# Altium schematic sheet STM32F4_Schematics.SchDoc
size A4
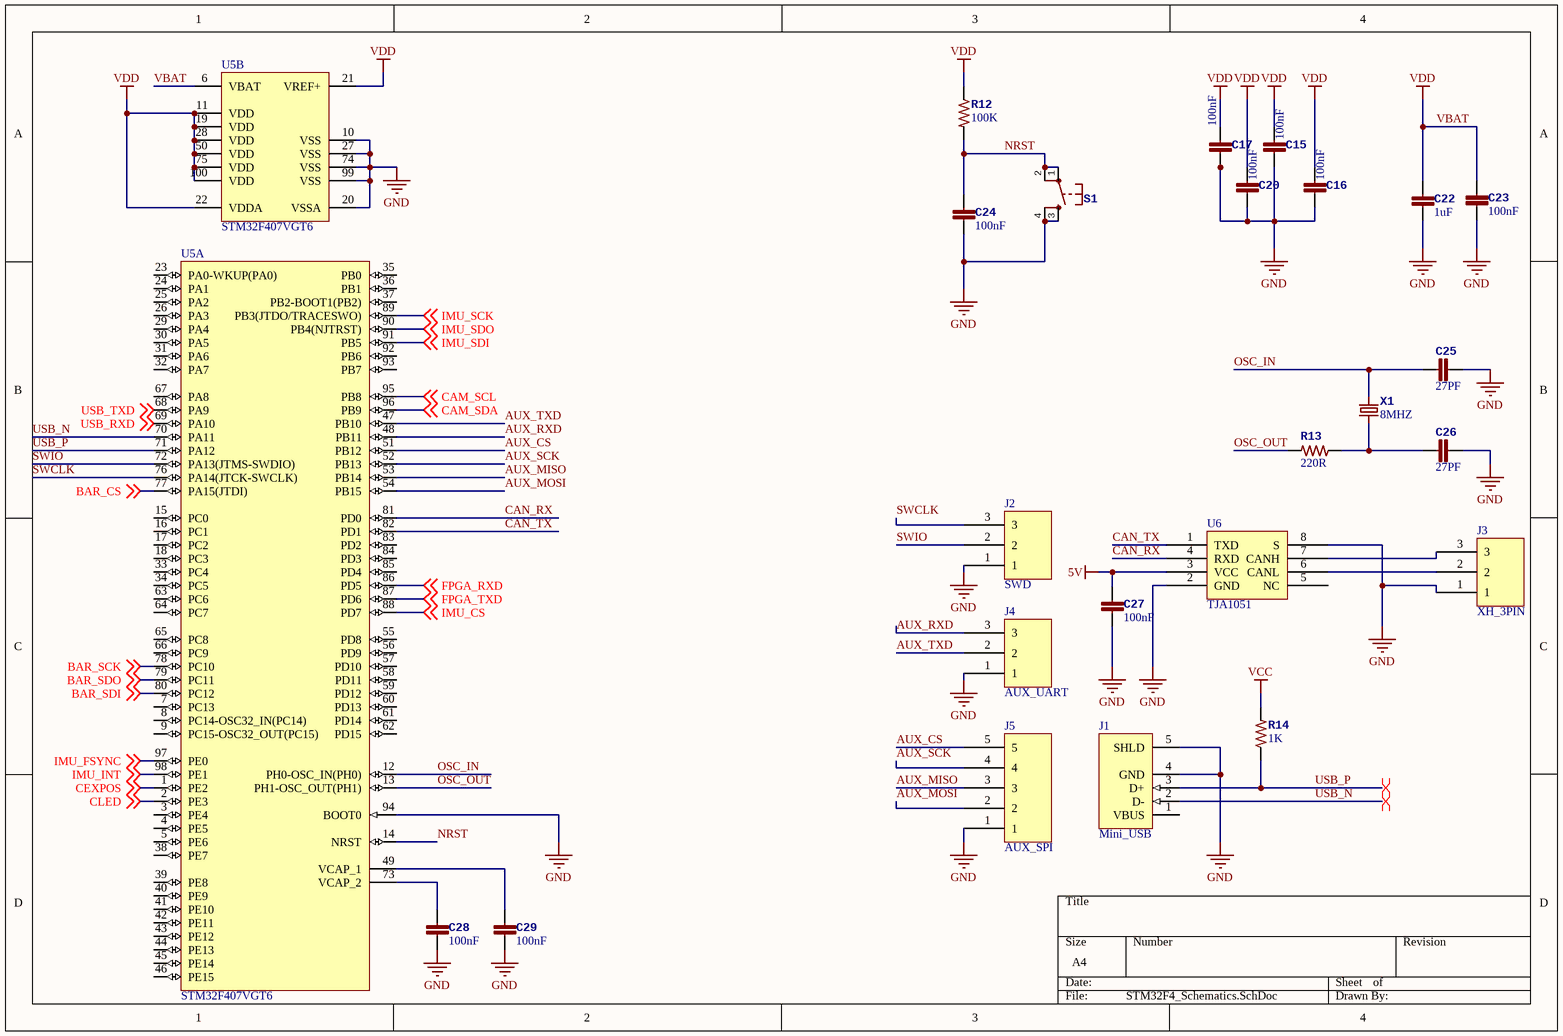
[diagram p0: STM32F4_Schematics.SchDoc]

## Parts
C15  value 100nF  [_0805]  (hidden comment: Cap)
C16  value 100nF  [_0805]  (hidden comment: Cap)
C17  value 100nF  [_0805]  (hidden comment: Cap)
C20  value 100nF  [_0805]  (hidden comment: Cap)
C22  value 1uF  [_0805]  (hidden comment: Cap)
C23  value 100nF  [_0805]  (hidden comment: Cap)
C24  value 100nF  [_0805]  (hidden comment: Cap)
C25  value 27PF  [_0805]  (hidden comment: Cap)
C26  value 27PF  [_0805]  (hidden comment: Cap)
C27  value 100nF  [_0805]  (hidden comment: Cap)
C28  value 100nF  [_0805]  (hidden comment: Cap)
C29  value 100nF  [_0805]  (hidden comment: Cap)
J1  Mini_USB  [My_USB]
J2  SWD  [XH_3PIN]
J3  XH_3PIN  [XH_3PIN]
J4  AUX_UART  [XH_3PIN]
J5  AUX_SPI  [XH_5PIN]
R12  value 100K  [_0603]  (hidden comment: Resistor)
R13  value 220R  [_0603]  (hidden comment: Resistor)
R14  value 1K  [_0603]  (hidden comment: Resistor)
S1  PushButton-4Pin  [_TACTILE_SWITCH_PTH_6.0MM]  (value not drawn)
U5  STM32F407VGT6  [STM-LQFP100_N]  (parts A,B of 2)
U6  TJA1051  [SO-8N]
X1  value 8MHZ  [_CRYSTAL-HC49UP]  (hidden comment: Crystal_1)

## Nets
5V: C27.2 U6.3(VCC)
GND: C15.1 C16.1 C17.1 C20.1 C22.1 C23.1 C24.2 C25.2 C26.2 C27.1 C28.1 C29.1 J1.4(GND) J1.5(SHLD) J2.1 J3.1 J4.1 J5.1 S1.3 S1.4 U5.10(VSS) U5.20(VSSA) U5.27(VSS) U5.74(VSS) U5.94(BOOT0) U5.99(VSS) U6.2(GND) U6.8(S)
VBAT: C15.2 C16.2 C17.2 C20.2 C22.2 C23.2 R12.1 U5.6(VBAT) U5.11(VDD) U5.19(VDD) U5.21(VREF+) U5.22(VDDA) U5.28(VDD) U5.50(VDD) U5.75(VDD) U5.100(VDD)  [also labelled VDD]
VCC: R14.2
AUX_CS: J5.5 U5.51(PB12)
AUX_MISO: J5.3 U5.53(PB14)
AUX_MOSI: J5.2 U5.54(PB15)
AUX_RXD: J4.3 U5.48(PB11)
AUX_SCK: J5.4 U5.52(PB13)
AUX_TXD: J4.2 U5.47(PB10)
BAR_CS: U5.77(PA15(JTDI)) ; off-sheet BAR_CS
BAR_SCK: U5.78(PC10) ; off-sheet BAR_SCK
BAR_SDI: U5.80(PC12) ; off-sheet BAR_SDI
BAR_SDO: U5.79(PC11) ; off-sheet BAR_SDO
CAM_SCL: U5.95(PB8) ; off-sheet CAM_SCL
CAM_SDA: U5.96(PB9) ; off-sheet CAM_SDA
CAN_RX: U5.81(PD0) U6.4(RXD)
CAN_TX: U5.82(PD1) U6.1(TXD)
CEXPOS: U5.1(PE2) ; off-sheet CEXPOS
CLED: U5.2(PE3) ; off-sheet CLED
FPGA_RXD: U5.86(PD5) ; off-sheet FPGA_RXD
FPGA_TXD: U5.87(PD6) ; off-sheet FPGA_TXD
IMU_CS: U5.88(PD7) ; off-sheet IMU_CS
IMU_FSYNC: U5.97(PE0) ; off-sheet IMU_FSYNC
IMU_INT: U5.98(PE1) ; off-sheet IMU_INT
IMU_SCK: U5.89(PB3(JTDO/TRACESWO)) ; off-sheet IMU_SCK
IMU_SDI: U5.91(PB5) ; off-sheet IMU_SDI
IMU_SDO: U5.90(PB4(NJTRST)) ; off-sheet IMU_SDO
NRST: C24.1 R12.2 S1.1 S1.2 U5.14(NRST)
OSC_IN: C25.1 U5.12(PH0-OSC_IN(PH0)) X1.2
OSC_OUT: R13.2 U5.13(PH1-OSC_OUT(PH1))
SWCLK: J2.3 U5.76(PA14(JTCK-SWCLK))
SWIO: J2.2 U5.72(PA13(JTMS-SWDIO))
USB_N: J1.2(D-) U5.70(PA11)
USB_P: J1.3(D+) R14.1 U5.71(PA12)
USB_RXD: U5.69(PA10) ; off-sheet USB_RXD
USB_TXD: U5.68(PA9) ; off-sheet USB_TXD
NetC26_1: C26.1 R13.1 X1.1
NetC28_2: C28.2 U5.73(VCAP_2)
NetC29_2: C29.2 U5.49(VCAP_1)
NetJ3_2: J3.2 U6.6(CANL)
NetJ3_3: J3.3 U6.7(CANH)

Not connected (* = marked no-connect by the designer): J1 1(VBUS); U5 3(PE4) 4(PE5) 5(PE6) 7(PC13) 8(PC14-OSC32_IN(PC14)) 9(PC15-OSC32_OUT(PC15)) 15(PC0) 16(PC1) 17(PC2) 18(PC3) 23(PA0-WKUP(PA0)) 24(PA1) 25(PA2) 26(PA3) 29(PA4) 30(PA5) 31(PA6) 32(PA7) 33(PC4) 34(PC5) 35(PB0) 36(PB1) 37(PB2-BOOT1(PB2)) 38(PE7) 39(PE8) 40(PE9) 41(PE10) 42(PE11) 43(PE12) 44(PE13) 45(PE14) 46(PE15) 55(PD8) 56(PD9) 57(PD10) 58(PD11) 59(PD12) 60(PD13) 61(PD14) 62(PD15) 63(PC6) 64(PC7) 65(PC8) 66(PC9) 67(PA8) 83(PD2) 84(PD3) 85(PD4) 92(PB6) 93(PB7); U6 5(NC)

## Layout directives
differential pair: USB_N, USB_P

## Library data of the parts
C15-C17 C20 C22-C29 = Cap_1
J1 = Mini_USB: USB 2.0, Right Angle, SMT, B Type, Receptacle, 5 Position, Black; ContactMaterial: Copper Alloy; ContactPlating: Gold (30); PCB_Layout: Complies with manufacturer's recommendation.; DrillSize: Corresponds to nominal value.; PanelGround: Without; Published: 15-Jul-2004; DatasheetDocument: 27-Jun-2003; PackageDocument: 27-Jun-2003; PackageReference: 440247; Publisher: Altium Limited; HousingMaterial: Thermoplastic; ComponentLink1Description: Manufacturer Link; ComponentLink1URL: http://www.tycoelectronics.com/; ComponentLink2Description: Packaging Specification; ComponentLink2URL: http://ecommas.tycoelectronics.com/commerce/DocumentDelivery/DDEController?Action=showdoc&DocId=Customer+Drawing%7F440247%7FD%7Fpdf%7FEnglish%7FC_440247_D.pdf
J2 J4 = XH_3PIN
J5 = XH_5PIN
S1 = PushButton-4Pin: PROD_ID: SWCH-13065
U5 = STM32F407VGT6: ARM Cortex-M4 32-bit MCU+FPU, 210 DMIPS, 1024 kB Flash, 192 kB Internal RAM, 82 I/Os, 100-pin LQFP, -40 to 85 degC, Tray; Manufacturer: STMicroelectronics; D/A Converter: 2x12-bit; FLASH Size (Prog) (kB): 1024; I/Os (High Current): 82; Internal RAM Size (kB): 192; Operating Frequency(F) (Processor speed) (MHz): 168; Supply Voltage(Vcc) max (V): 3.6; Supply Voltage(Vcc) min (V): 1.8; DatasheetVersion: Rev. 4; PackageVersion: Rev. 1, 06/2013; PackageReference: LQFP100; PackageDescription: 100-Pin Low Profile Quad Flat Package, 14 x 14 mm Body, 0.5 mm Pitch; Supplier 1: Digi-Key; Supplier Part Number 1: 497-11605-ND; Supplier 2: Farnell; Supplier Part Number 2: 2064368; Supplier 3: Newark; Supplier Part Number 3: 73T2333; Supplier 4: Mouser; Supplier Part Number 4: 511-STM32F407VGT6; Core: ARM Cortex-M4; Packing: Tray; Mounting Technology: Surface Mount; PartNumber: STM32F407VGT6; ComponentLink1Description: Manufacturer URL; ComponentLink1URL: http://www.st.com/web/en/home.html; ComponentLink2Description: Datasheet; ComponentLink2URL: http://www.st.com/st-web-ui/static/active/en/resource/technical/document/datasheet/DM00037051.pdf; ComponentLink3Description: Package Specification; ComponentLink3URL: http://www.st.com/st-web-ui/static/active/en/resource/technical/document/data_brief/DM00071938.pdf